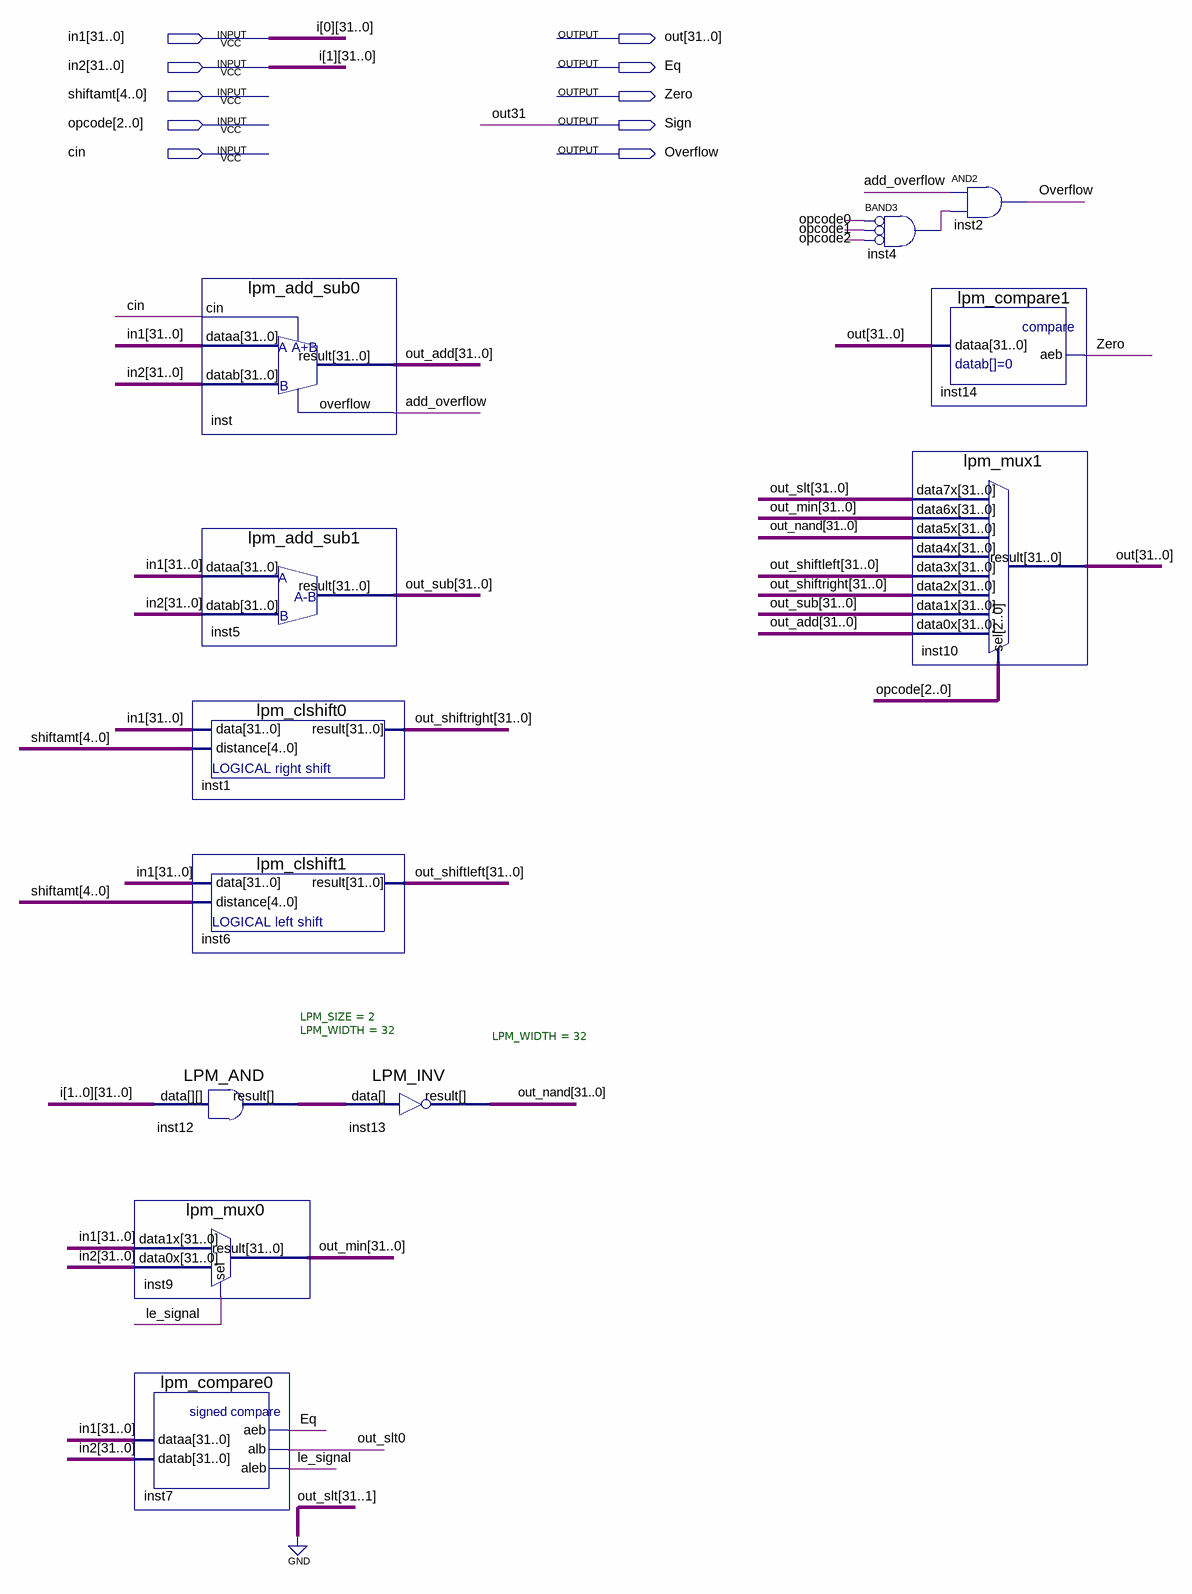
[diagram p0: schematic sheet]
// Quartus schematic ALU.bdf as structural Verilog: 12 symbols, 10 pins
module ALU (
  input  [31:0] in1,
  input  [31:0] in2,
  input  [4:0] shiftamt,
  input  [2:0] opcode,
  input  cin,
  output [31:0] out,
  output Eq,
  output Zero,
  output Sign,
  output Overflow
);

  wire add_overflow, inst4_out, le_signal;
  wire [0:0] out_slt;
  wire [31:0] inst12_result, out_add, out_min, out_nand, out_shiftleft, out_shiftright, out_sub;

  lpm_clshift0 inst1 (.data(in1), .distance(shiftamt), .result(out_shiftright));
  lpm_clshift1 inst6 (.data(in1), .distance(shiftamt), .result(out_shiftleft));
  LPM_AND #(.LPM_SIZE(2), .LPM_WIDTH(32)) inst12 (.data({in2, in1}), .result(inst12_result));
  lpm_mux0 inst9 (.data1x(in1), .data0x(in2), .sel(le_signal), .result(out_min));
  lpm_compare0 inst7 (.dataa(in1), .datab(in2), .aeb(Eq), .alb(out_slt[0]), .aleb(le_signal));
  lpm_add_sub0 inst (.cin(cin), .dataa(in1), .datab(in2), .result(out_add), .overflow(add_overflow));
  lpm_add_sub1 inst5 (.dataa(in1), .datab(in2), .result(out_sub));
  LPM_INV #(.LPM_WIDTH(32)) inst13 (.data(inst12_result), .result(out_nand));
  and inst4 (inst4_out, ~opcode[0], ~opcode[1], ~opcode[2]);  // BAND3
  and inst2 (Overflow, add_overflow, inst4_out);
  lpm_compare1 inst14 (.dataa(out), .aeb(Zero));
  lpm_mux1 inst10 (
    .data7x({{31{1'b0}}, out_slt[0]}), .data6x(out_min), .data5x(out_nand), .data3x(out_shiftleft),
    .data2x(out_shiftright), .data1x(out_sub), .data0x(out_add), .sel(opcode), .result(out));  // open: data4x

  assign Sign = out[31];

  // Other names for the same wires on the sheet: i_0[31:0] = in1; i_1[31:0] = in2
endmodule
